# Altium schematic sheet AUX_CPU_SCH.SchDoc
size A
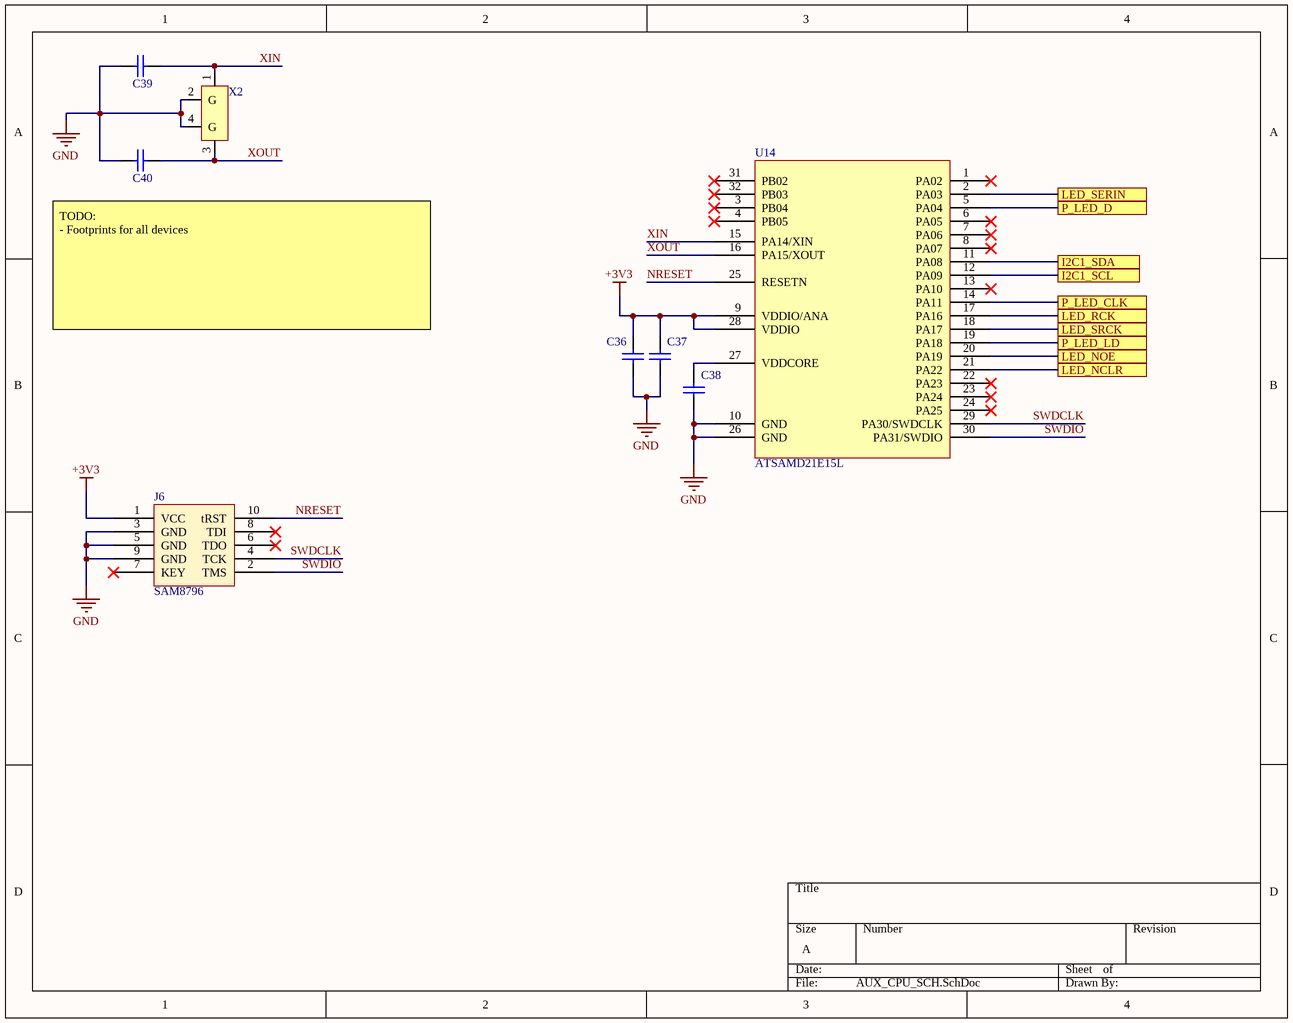
[diagram p0: AUX_CPU_SCH.SchDoc]

## Parts
C36  CAP0402  [CAPC0402(1005)60_L]  (value not drawn)
C37  CAP0402  [CAPC0402(1005)60_L]  (value not drawn)
C38  CAP0402  [CAPC0402(1005)60_L]  (value not drawn)
C39  CAP0402  [CAPC0402(1005)60_L]  (value not drawn)
C40  CAP0402  [CAPC0402(1005)60_L]  (value not drawn)
J6  SAM8796
U14  ATSAMD21E15L
X2  ECS-480-18-30B-AGN-TR  (value not drawn)

## Ports
I2C1_SCL, I2C1_SDA, LED_NCLR, LED_NOE, LED_RCK, LED_SERIN, LED_SRCK, P_LED_CLK, P_LED_D, P_LED_LD

## Nets
+3V3: C36.2 C37.2 J6.1(VCC) U14.9(VDDIO/ANA) U14.28(VDDIO)
GND: C36.1 C37.1 C38.1 C39.2 C40.2 J6.3(GND) J6.5(GND) J6.9(GND) U14.10(GND) U14.26(GND) X2.2(G) X2.4(G)
I2C1_SCL: U14.12(PA09) ; port I2C1_SCL
I2C1_SDA: U14.11(PA08) ; port I2C1_SDA
LED_NCLR: U14.21(PA22) ; port LED_NCLR
LED_NOE: U14.20(PA19) ; port LED_NOE
LED_RCK: U14.17(PA16) ; port LED_RCK
LED_SERIN: U14.2(PA03) ; port LED_SERIN
LED_SRCK: U14.18(PA17) ; port LED_SRCK
NRESET: J6.10(tRST) U14.25(RESETN)
P_LED_CLK: U14.14(PA11) ; port P_LED_CLK
P_LED_D: U14.5(PA04) ; port P_LED_D
P_LED_LD: U14.19(PA18) ; port P_LED_LD
SWDCLK: J6.4(TCK) U14.29(PA30/SWDCLK)
SWDIO: J6.2(TMS) U14.30(PA31/SWDIO)
XIN: C39.1 U14.15(PA14/XIN) X2.1(XIN)
XOUT: C40.1 U14.16(PA15/XOUT) X2.3(XOUT)
NetC38_2: C38.2 U14.27(VDDCORE)

Not connected (* = marked no-connect by the designer): J6 6(TDO)* 7(KEY)* 8(TDI)*; U14 1(PA02)* 3(PB04)* 4(PB05)* 6(PA05)* 7(PA06)* 8(PA07)* 13(PA10)* 22(PA23)* 23(PA24)* 24(PA25)* 31(PB02)* 32(PB03)*

## Notes on the sheet
- TODO:
  - Footprints for all devices

## Library data of the parts
C36 C38 = CMP-1590-00004-1: 0402 (1005 Metric) Chip Capacitor; Case-EIA: 0402; Value: 1u; Case-Metric: 1005; PackageReference: CAPC0402(1005)60
C37 = CMP-1590-00004-1: 0402 (1005 Metric) Chip Capacitor; Case-EIA: 0402; Value: 100n; Case-Metric: 1005; PackageReference: CAPC0402(1005)60
C39 C40 = CMP-1590-00004-1: 0402 (1005 Metric) Chip Capacitor; Case-EIA: 0402; Value: 18pF; Case-Metric: 1005; PackageReference: CAPC0402(1005)60